# EAGLE schematic TimeLord (EAGLE 6.5.0)
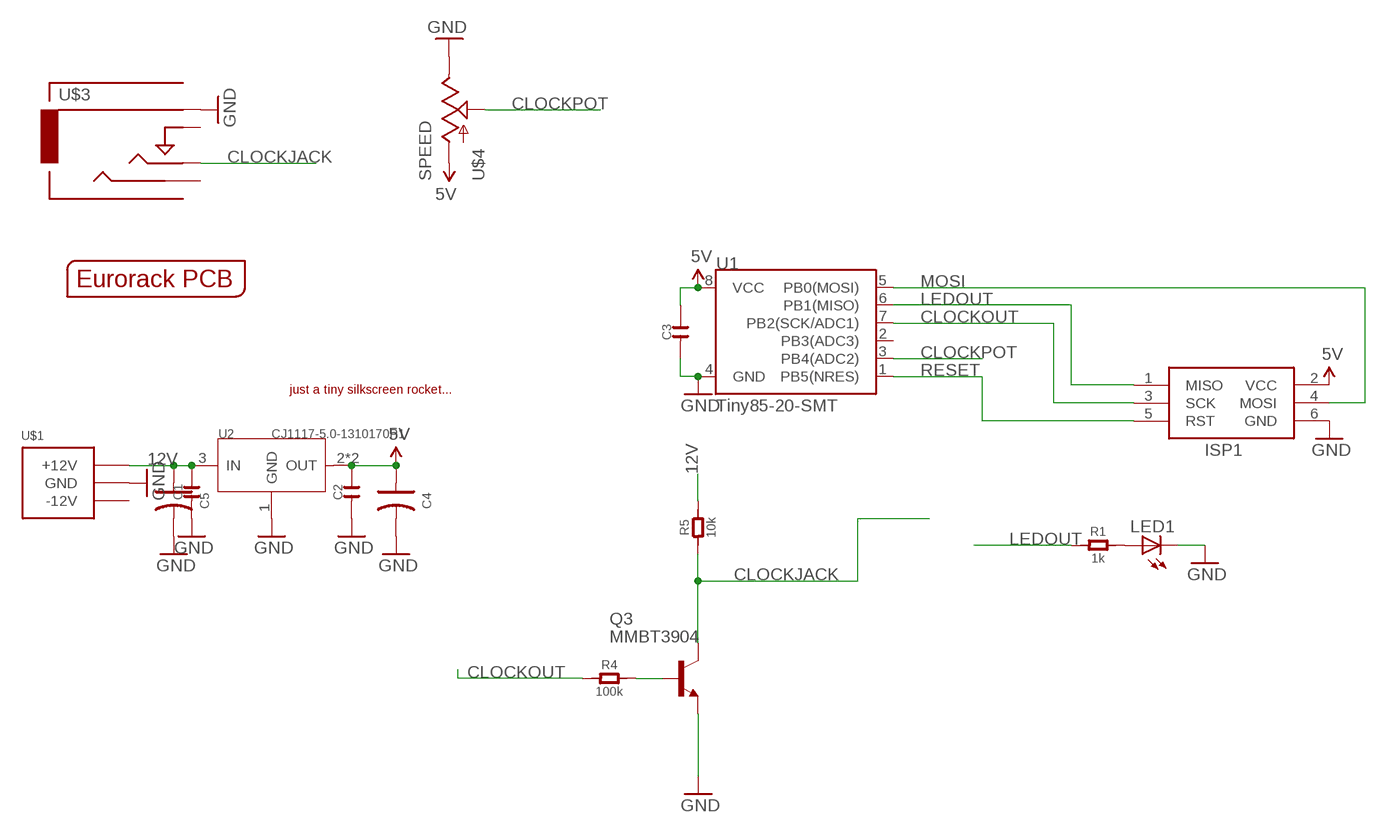
[diagram p0: schematic, sheet 1]

## Parts
C1  C-0603  [C0603]
C2  C-0603  [C0603]
C3  C-0603  [C0603]
C4  C-POLAR-A  [AVX-A]
C5  C-POLAR-A  [AVX-A]
ISP1  AVRISP-6  [AVRISP]
LED1  LED3MM  [LED3MM]
Q3  MMBT3904  MMBT3904LT1-NPN-SOT23-BEC  [SOT23-BEC]
R1  1k  R-0603  [R0603]
R4  100k  R-0603  [R0603]
R5  10k  R-0603  [R0603]
U1  Tiny85-20-SMT  ATTINY45TINY85-20-SMT  [SO08-EIAJ]
U2  CJ1117-5.0-1310170P1  [SOT223]
U$1  POWER_SIMPLE10  [POWER_10]
U$2  EURORACK_PCB4HP  [EURORACK4HPPCB]
U$3  CLOCK  AUDIO-JACKOUTPUT  [3.5MM-JACK-SWITCH-13MM-OUTPUT]
U$4  SPEED  POTZEPHPOT  [OG-POTS_ALPS_POT_VERTICAL]
U$5  JUSTATINYROCKET  [JUSTATINYROCKET]

## Nets
5V: C2.2 C3.2 C4.+ ISP1.2(VCC) U1.8(VCC) U2.2(OUT) U2.TER(OUT) U$4.P$3(A)
12V: C1.2 C5.+ R5.2 U2.3(IN) U$1.9(+12V) U$1.10(+12V)
CLOCKJACK: Q3.C R5.1 U$3.TIP@1(TIP) U$3.TIP@2(TIP)
CLOCKOUT: ISP1.3(SCK) R4.1 U1.7(PB2(SCK/ADC1))
CLOCKPOT: U1.3(PB4(ADC2)) U$4.P$2(S)
GND: C1.1 C2.1 C3.1 C4.- C5.- ISP1.6(GND) LED1.K(C) Q3.E U1.4(GND) U2.1(GND) U$1.3(GND) U$1.4(GND) U$1.5(GND) U$1.6(GND) U$1.7(GND) U$1.8(GND) U$3.RING@1(RING) U$3.RING@2(RING) U$4.P$1(E)
LEDOUT: ISP1.1(MISO) R1.1 U1.6(PB1(MISO))
MOSI: ISP1.4(MOSI) U1.5(PB0(MOSI))
N$4: LED1.A R1.2
N$9: Q3.B R4.2
RESET: ISP1.5(RST) U1.1(PB5(NRES))
Unconnected: U1.2(PB3(ADC3)) U$1.1(-12V) U$1.2(-12V) U$3.SECOND@1(SECOND) U$3.SECOND@2(SECOND) U$3.SWITCH@1(SWITCH) U$3.SWITCH@2(SWITCH)

## Library data of the parts
C1-C3 = OPL:C*
C4 C5 = OPL:C-POLAR*
ISP1 = adafruit:AVRISP: AVR ISP HEADER Standard 6 pin header for AVR programming
LED1 = SparkFun-LED:LED: LEDs Standard schematic elements and footprints for 5mm, 3mm, 1206, and 0603 sized LEDs. 5mm - Spark Fun Electronics SKU : COM-00529 (and others)
Q3 = transistor:*-NPN-: NPN Transistror BF959 corrected 2008.03.06
R1 R4 R5 = OPL:R*
U1 = SparkFun-DigitalIC:ATTINY45: Atmel 8-pin 2/4/8kB flash uC; PROD_ID: IC-09092
U2 = OPL:CJ1117-5.0
U$1 = EurorackModularParts:POWER_SIMPLE
U$2 = EurorackModularParts:EURORACK_PCB
U$3 = EurorackModularParts:AUDIO-JACK: Switching Mono 3.5mm Audio Jack from Erthenvar.
U$4 = EurorackModularParts:POT
U$5 = zephod-components:JUSTATINYROCKET